# EasyEDA schematic SCH_YZ_FFC_to_Microfit_2022-07-01.json
TITLE: Sheet_1; REV: 1.0; Date: 2022-04-02; Sheet: 1/1; Drawn By: Edward Niedziejko; Company: Your Company
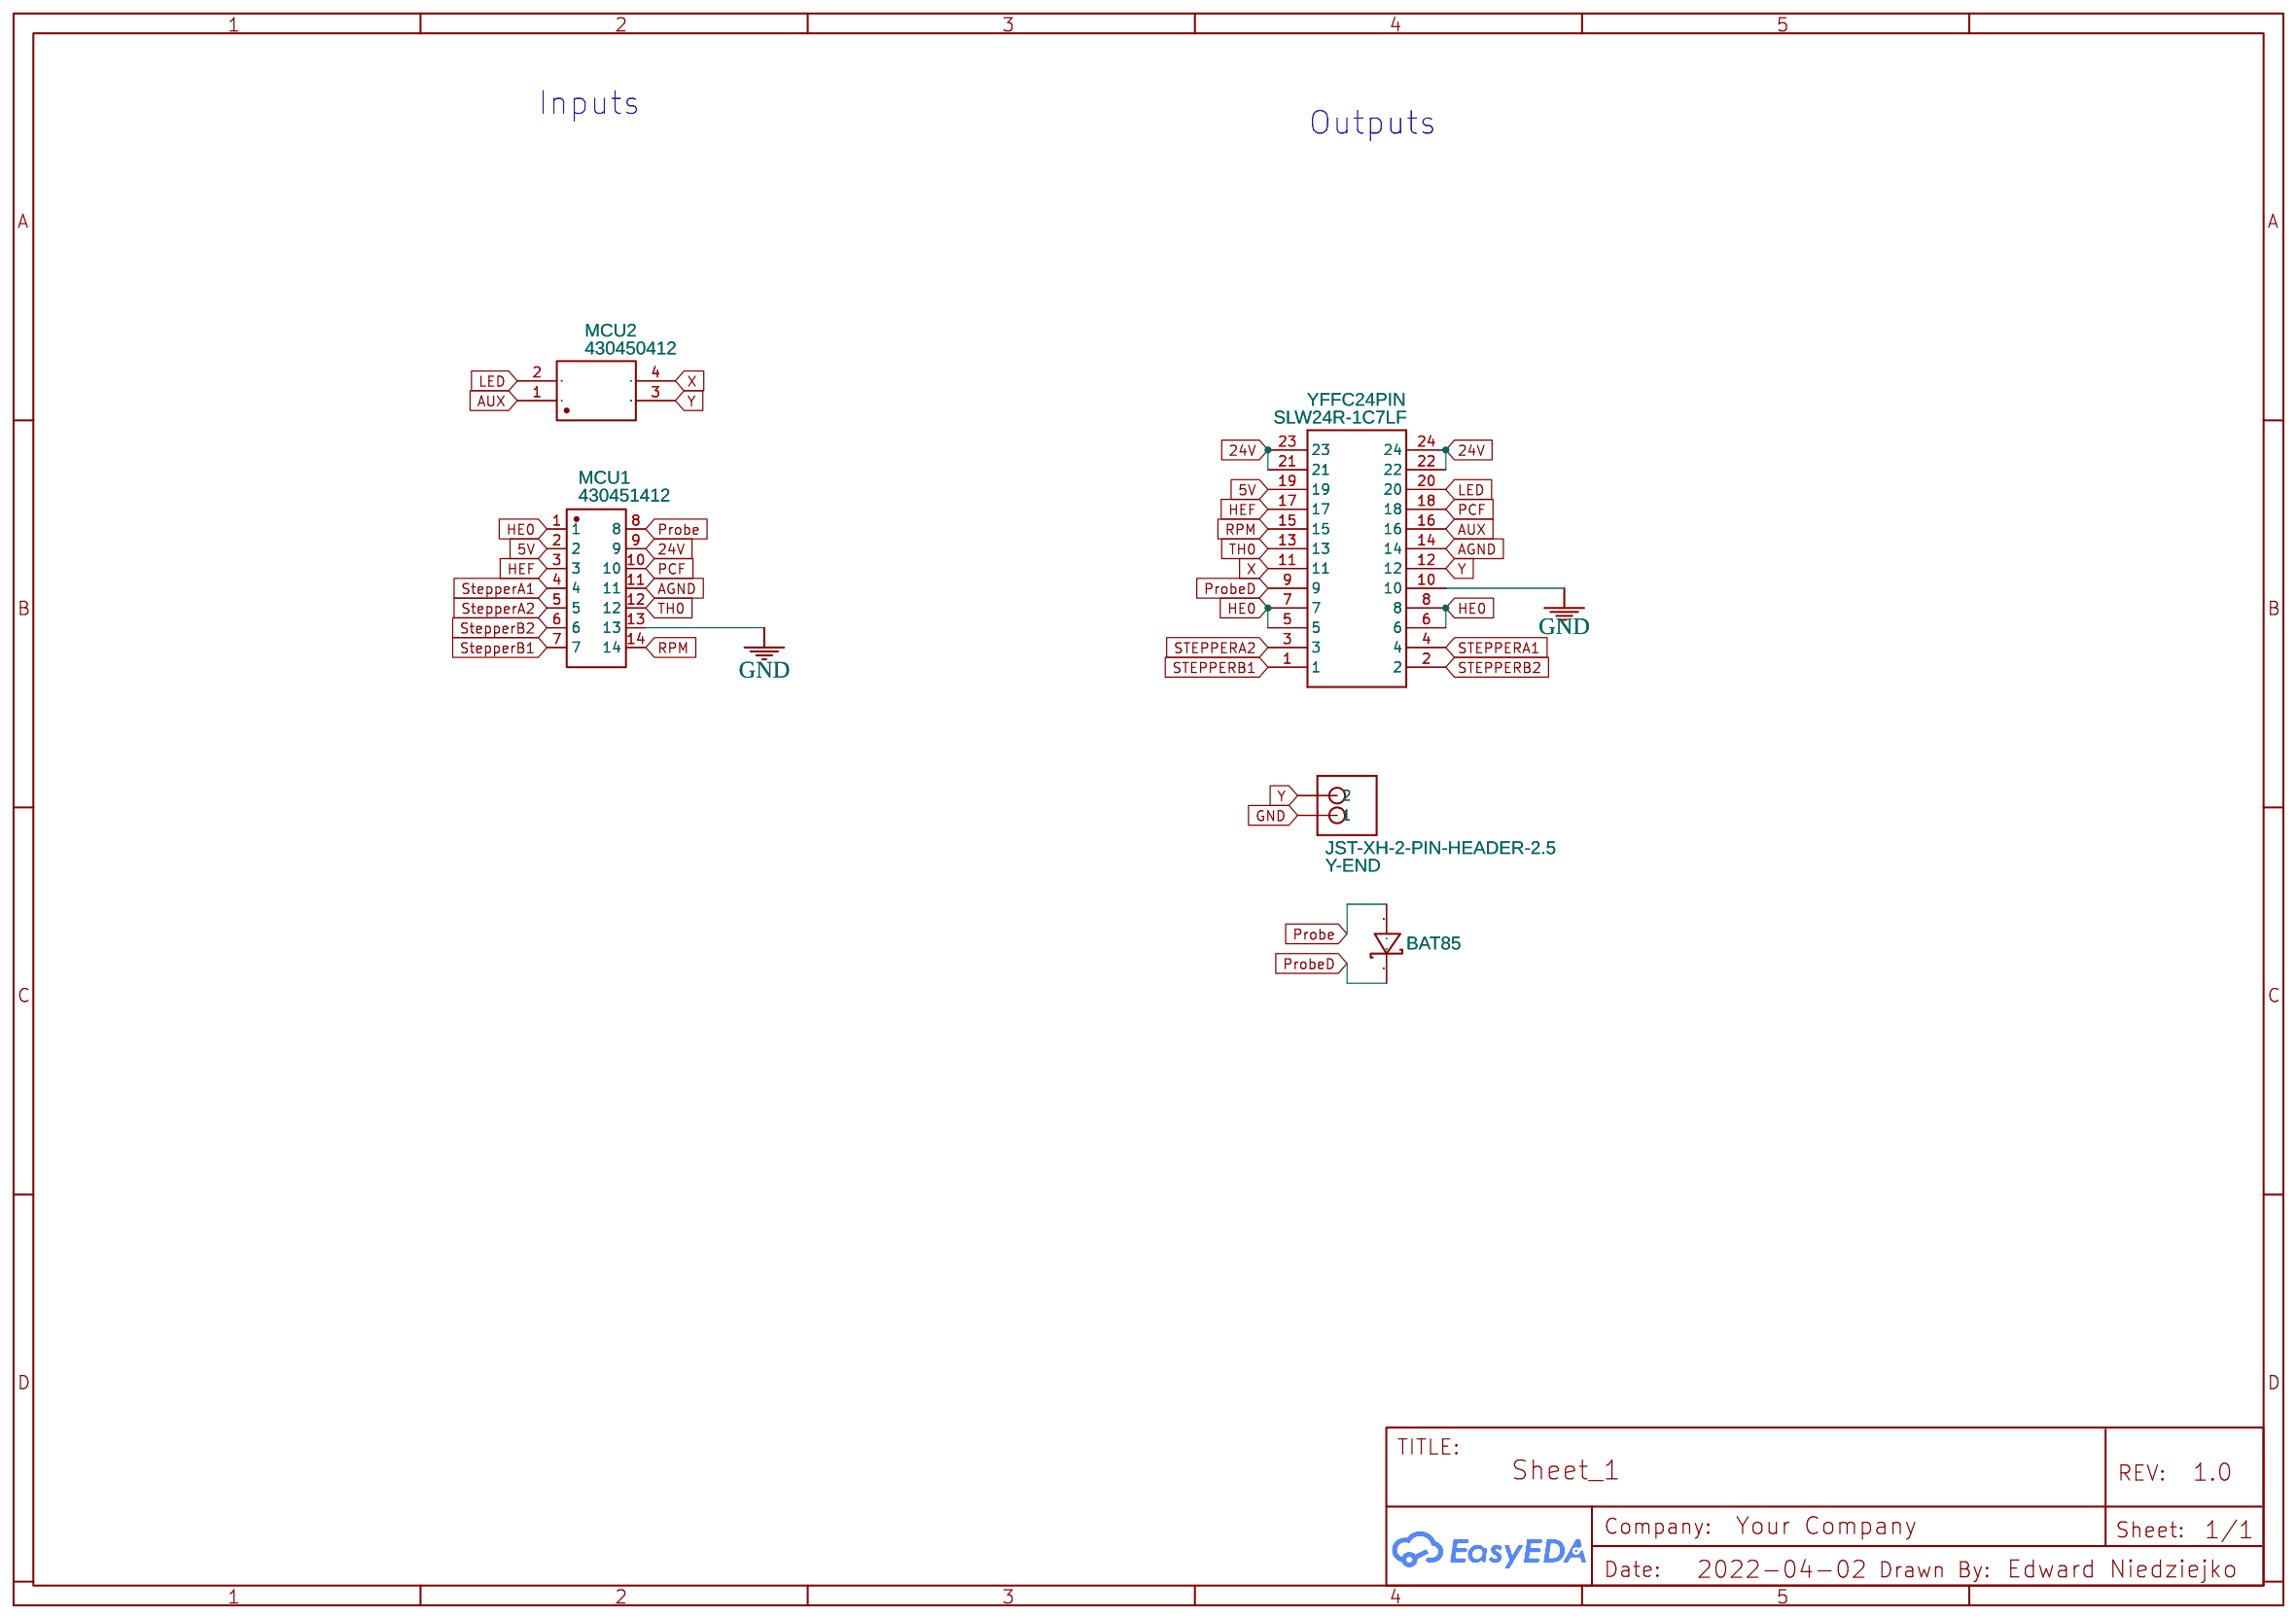
[diagram p0: schematic sheet]

## Parts
BAT85  BAT85  [DO-34_BD1.6-L3.0-P7.00-D0.6-RD]
MCU1  430451412  [CONN-TH_430451412]
MCU2  430450412  [CONN-TH_4P-P3.00-S3.00_L7.4-W9.7-EH9.0]
Y-END  JST-XH-2-PIN-HEADER-2.5  [JST-XH-2PIN-2.5]
YFFC24PIN  SLW24R-1C7LF  [SLW24R1C7LF]

## Library data of the parts
BAT85 = BAT85,133: Supplier: LCSC; Manufacturer: Nexperia; Contributor: LCSC; Supplier Part: C134301; LCSC Assembly: Yes; SMT Type: Extend
MCU1 = 430451412: Supplier: LCSC; Supplier Part: C293738; Manufacturer: MOLEX; Contributor: LCSC; JLCPCB Part Class: Extended Part
MCU2 = 430450412: Supplier: LCSC; Supplier Part: C277721; Manufacturer: MOLEX; Contributor: LCSC; JLCPCB Part Class: Extended Part
Y-END = JST-XH-2-PIN-HEADER-2.5: Contributor: hs3uka
YFFC24PIN = SLW24R-1C7LF: Contributor: Edward Niedziejko

## Nets
5V: MCU1.2 YFFC24PIN.19
24V: MCU1.9 YFFC24PIN.21 YFFC24PIN.22 YFFC24PIN.23 YFFC24PIN.24
AGND: MCU1.11 YFFC24PIN.14
GND: MCU1.13 Y-END.1 YFFC24PIN.10
AUX: MCU2.1 YFFC24PIN.16
HE0: MCU1.1 YFFC24PIN.5 YFFC24PIN.6 YFFC24PIN.7 YFFC24PIN.8
HEF: MCU1.3 YFFC24PIN.17
LED: MCU2.2 YFFC24PIN.20
PCF: MCU1.10 YFFC24PIN.18
Probe: BAT85.2(A) MCU1.8
ProbeD: BAT85.1(K) YFFC24PIN.9
RPM: MCU1.14 YFFC24PIN.15
StepperA1: MCU1.4
STEPPERA1: YFFC24PIN.4
StepperA2: MCU1.5
STEPPERA2: YFFC24PIN.3
StepperB1: MCU1.7
STEPPERB1: YFFC24PIN.1
StepperB2: MCU1.6
STEPPERB2: YFFC24PIN.2
TH0: MCU1.12 YFFC24PIN.13
X: MCU2.4 YFFC24PIN.11
Y: MCU2.3 Y-END.2 YFFC24PIN.12

## Notes on the sheet
- Inputs
- Outputs
